# EAGLE design StandaloneAnemometer_RevA (EAGLE 7.4.0)

## Sheet 1 of 3
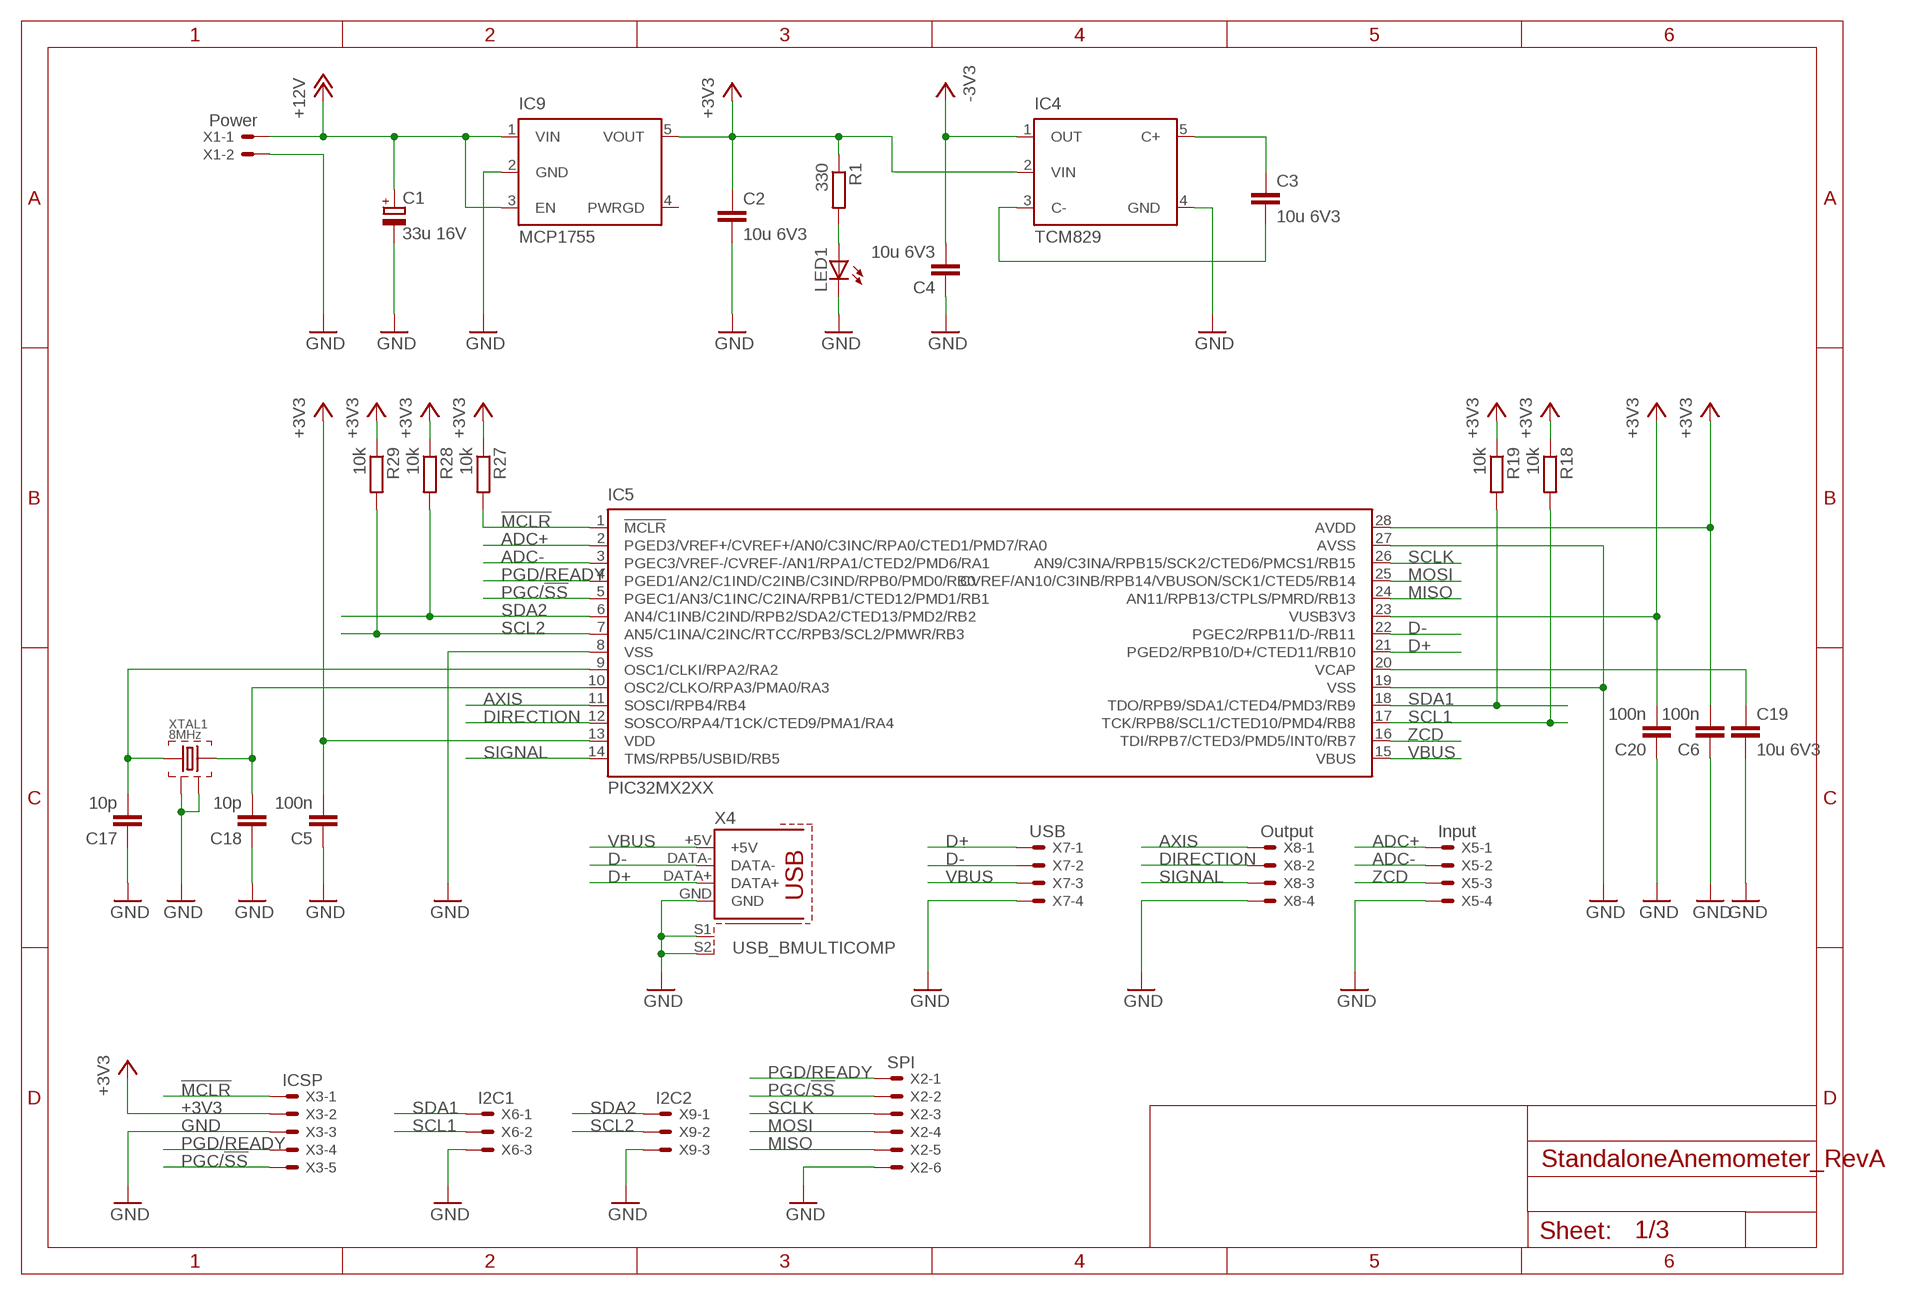
[diagram p0: schematic, sheet 1]

### Parts
C1  33u 16V  C_POLARIZEDSMC_B  [SMC_B]
C2  10u 6V3  CC0805  [C0805]
C3  10u 6V3  CC0805  [C0805]
C4  10u 6V3  CC0805  [C0805]
C5  100n  CC0805  [C0805]
C6  100n  CC0805  [C0805]
C17  10p  CC0805  [C0805]
C18  10p  CC0805  [C0805]
C19  10u 6V3  CC0805  [C0805]
C20  100n  CC0805  [C0805]
IC4  TCM829  [SOT-23-5]
IC5  PIC32MX2XX  [SO28W]
IC9  MCP1755  [SOT-23-5]
LED1  LED0805  [LED0805]
R1  330  RESISTORR0805  [R0805]
R18  10k  RESISTORR0805  [R0805]
R19  10k  RESISTORR0805  [R0805]
R27  10k  RESISTORR0805  [R0805]
R28  10k  RESISTORR0805  [R0805]
R29  10k  RESISTORR0805  [R0805]
X1  Power  22-23-2021100MIL  [22-23-2021]
X2  SPI  22-23-2061  [22-23-2061]
X3  ICSP  22-23-2051  [22-23-2051]
X4  USB_BMULTICOMP  [USB_B]
X5  Input  22-23-20411MM  [22-23-2041]
X6  I2C1  22-23-2031  [22-23-2031]
X7  USB  22-23-20411MM  [22-23-2041]
X8  Output  22-23-20411MM  [22-23-2041]
X9  I2C2  22-23-2031  [22-23-2031]
XTAL1  8MHz  CRYSTAL_SHIELDED  [5X3.2MM]

### Nets
!MCLR!: IC5.1(!MCLR!) R27.2 X3.1
+3V3: C2.1 C5.2 C6.2 C20.2 IC4.2(VIN) IC5.13(VDD) IC5.23(VUSB3V3) IC5.28(AVDD) IC9.5(VOUT) R1.1 R18.1 R19.1 R27.1 R28.1 R29.1 X3.2 ; also sheet 2,3
+12V: C1.+ IC9.1(VIN) IC9.3(EN) X1.1 ; also sheet 2
-3V3: C4.2 IC4.1(OUT) ; also sheet 2,3
ADC+: IC5.2(PGED3/VREF+/CVREF+/AN0/C3INC/RPA0/CTED1/PMD7/RA0) X5.1 ; also sheet 3
ADC-: IC5.3(PGEC3/VREF-/CVREF-/AN1/RPA1/CTED2/PMD6/RA1) X5.2 ; also sheet 3
AXIS: IC5.11(SOSCI/RPB4/RB4) X8.1 ; also sheet 2,3
D+: IC5.21(PGED2/RPB10/D+/CTED11/RB10) X4.DATA+ X7.1
D-: IC5.22(PGEC2/RPB11/D-/RB11) X4.DATA- X7.2
DIRECTION: IC5.12(SOSCO/RPA4/T1CK/CTED9/PMA1/RA4) X8.2 ; also sheet 2,3
GND: C1.- C2.2 C4.1 C5.1 C6.1 C17.1 C18.1 C19.2 C20.1 IC4.4(GND) IC5.8(VSS) IC5.19(VSS) IC5.27(AVSS) IC9.2(GND) LED1.C X1.2 X2.6 X3.3 X4.GND X4.S1 X4.S2 X5.4 X6.3 X7.4 X8.4 X9.3 XTAL1.2 XTAL1.4 ; also sheet 2,3
MISO: IC5.24(AN11/RPB13/CTPLS/PMRD/RB13) X2.5
MOSI: IC5.25(CVREF/AN10/C3INB/RPB14/VBUSON/SCK1/CTED5/RB14) X2.4
N$1: LED1.A R1.2
N$3: C3.2 IC4.3(C-)
N$4: C3.1 IC4.5(C+)
N$5: C17.2 IC5.9(OSC1/CLKI/RPA2/RA2) XTAL1.1
N$9: C18.2 IC5.10(OSC2/CLKO/RPA3/PMA0/RA3) XTAL1.3
N$11: C19.1 IC5.20(VCAP)
PGC/!SS!: IC5.5(PGEC1/AN3/C1INC/C2INA/RPB1/CTED12/PMD1/RB1) X2.2 X3.5
PGD/READY: IC5.4(PGED1/AN2/C1IND/C2INB/C3IND/RPB0/PMD0/RB0) X2.1 X3.4
SCL1: IC5.17(TCK/RPB8/SCL1/CTED10/PMD4/RB8) R18.2 X6.2
SCL2: IC5.7(AN5/C1INA/C2INC/RTCC/RPB3/SCL2/PMWR/RB3) R29.2 X9.2 ; also sheet 3
SCLK: IC5.26(AN9/C3INA/RPB15/SCK2/CTED6/PMCS1/RB15) X2.3
SDA1: IC5.18(TDO/RPB9/SDA1/CTED4/PMD3/RB9) R19.2 X6.1
SDA2: IC5.6(AN4/C1INB/C2IND/RPB2/SDA2/CTED13/PMD2/RB2) R28.2 X9.1 ; also sheet 3
SIGNAL: IC5.14(TMS/RPB5/USBID/RB5) X8.3 ; also sheet 2
VBUS: IC5.15(VBUS) X4.+5V X7.3
ZCD: IC5.16(TDI/RPB7/CTED3/PMD5/INT0/RB7) X5.3 ; also sheet 3
Unconnected: IC9.4(PWRGD)

## Sheet 2 of 3
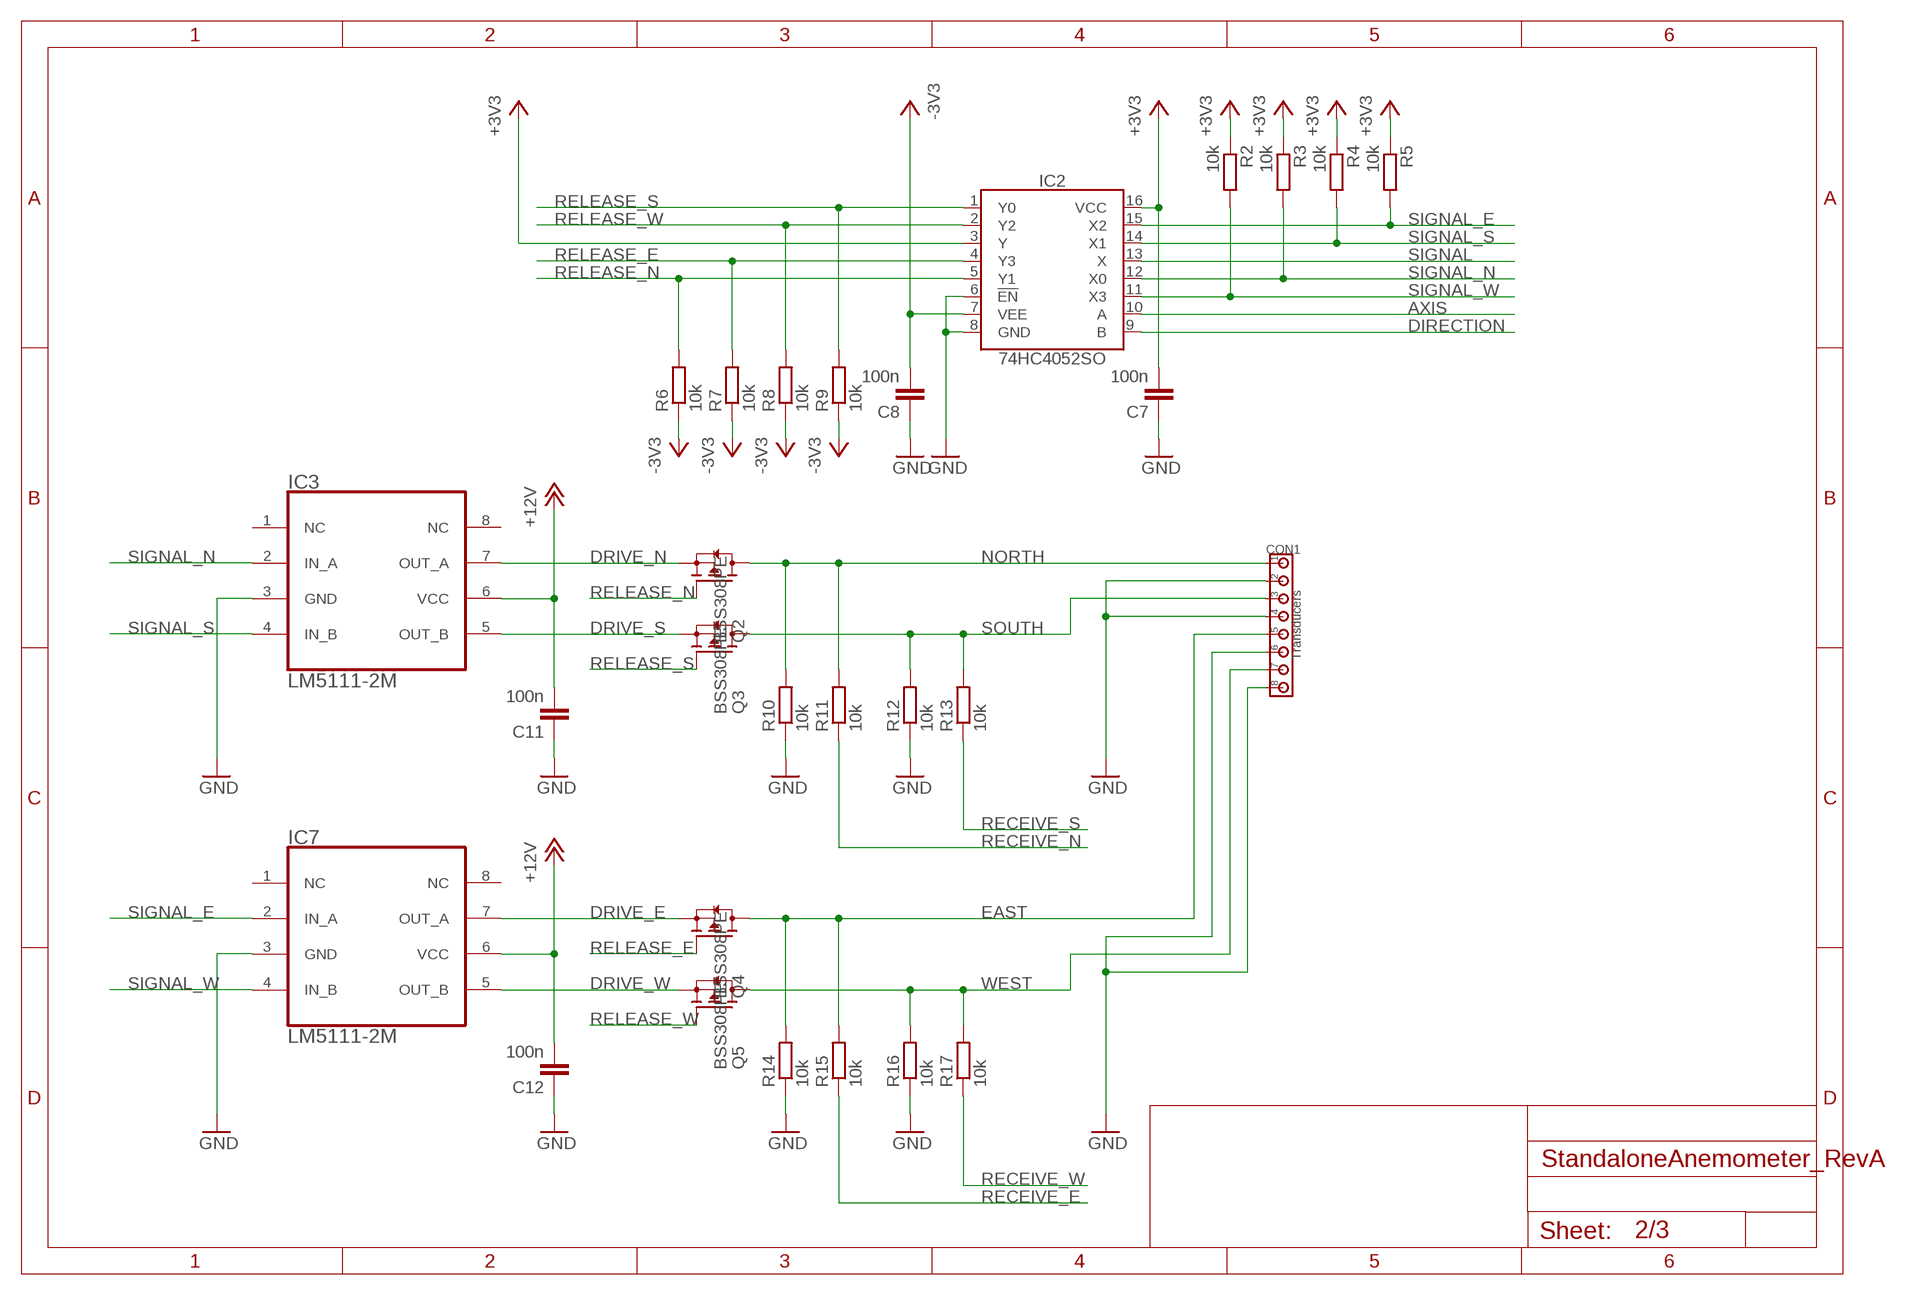
[diagram p1: schematic, sheet 2]

### Parts
C7  100n  CC0805  [C0805]
C8  100n  CC0805  [C0805]
C11  100n  CC0805  [C0805]
C12  100n  CC0805  [C0805]
CON1  Transducers  CON_8X3.5MM  [3.5MM_8X]
IC2  74HC4052SO  [SO16]
IC3  LM5111-2M  LM5111  [SOIC8]
IC7  LM5111-2M  LM5111  [SOIC8]
Q2  BSS308PE  P-FET  [SOT23]
Q3  BSS308PE  P-FET  [SOT23]
Q4  BSS308PE  P-FET  [SOT23]
Q5  BSS308PE  P-FET  [SOT23]
R2  10k  RESISTORR0805  [R0805]
R3  10k  RESISTORR0805  [R0805]
R4  10k  RESISTORR0805  [R0805]
R5  10k  RESISTORR0805  [R0805]
R6  10k  RESISTORR0805  [R0805]
R7  10k  RESISTORR0805  [R0805]
R8  10k  RESISTORR0805  [R0805]
R9  10k  RESISTORR0805  [R0805]
R10  10k  RESISTORR0805  [R0805]
R11  10k  RESISTORR0805  [R0805]
R12  10k  RESISTORR0805  [R0805]
R13  10k  RESISTORR0805  [R0805]
R14  10k  RESISTORR0805  [R0805]
R15  10k  RESISTORR0805  [R0805]
R16  10k  RESISTORR0805  [R0805]
R17  10k  RESISTORR0805  [R0805]

### Nets
+3V3: C7.2 IC2.3(Y) IC2.16(VCC) R2.1 R3.1 R4.1 R5.1 ; also sheet 1,3
+12V: C11.2 C12.2 IC3.6(VCC) IC7.6(VCC) ; also sheet 1
-3V3: C8.2 IC2.7(VEE) R6.1 R7.1 R8.1 R9.1 ; also sheet 1,3
AXIS: IC2.10(A) ; also sheet 1,3
DIRECTION: IC2.9(B) ; also sheet 1,3
DRIVE_E: IC7.7(OUT_A) Q4.2(S)
DRIVE_N: IC3.7(OUT_A) Q2.2(S)
DRIVE_S: IC3.5(OUT_B) Q3.2(S)
DRIVE_W: IC7.5(OUT_B) Q5.2(S)
EAST: CON1.5 Q4.3(D) R14.2 R15.2
GND: C7.1 C8.1 C11.1 C12.1 CON1.2 CON1.4 CON1.6 CON1.8 IC2.6(!EN!) IC2.8(GND) IC3.3(GND) IC7.3(GND) R10.1 R12.1 R14.1 R16.1 ; also sheet 1,3
NORTH: CON1.1 Q2.3(D) R10.2 R11.2
RECEIVE_E: R15.1 ; also sheet 3
RECEIVE_N: R11.1 ; also sheet 3
RECEIVE_S: R13.1 ; also sheet 3
RECEIVE_W: R17.1 ; also sheet 3
RELEASE_E: IC2.4(Y3) Q4.1(G) R7.2
RELEASE_N: IC2.5(Y1) Q2.1(G) R6.2
RELEASE_S: IC2.1(Y0) Q3.1(G) R9.2
RELEASE_W: IC2.2(Y2) Q5.1(G) R8.2
SIGNAL: IC2.13(X) ; also sheet 1
SIGNAL_E: IC2.15(X2) IC7.2(IN_A) R5.2
SIGNAL_N: IC2.12(X0) IC3.2(IN_A) R3.2
SIGNAL_S: IC2.14(X1) IC3.4(IN_B) R4.2
SIGNAL_W: IC2.11(X3) IC7.4(IN_B) R2.2
SOUTH: CON1.3 Q3.3(D) R12.2 R13.2
WEST: CON1.7 Q5.3(D) R16.2 R17.2
Unconnected: IC3.1(NC) IC3.8(NC) IC7.1(NC) IC7.8(NC)

## Sheet 3 of 3
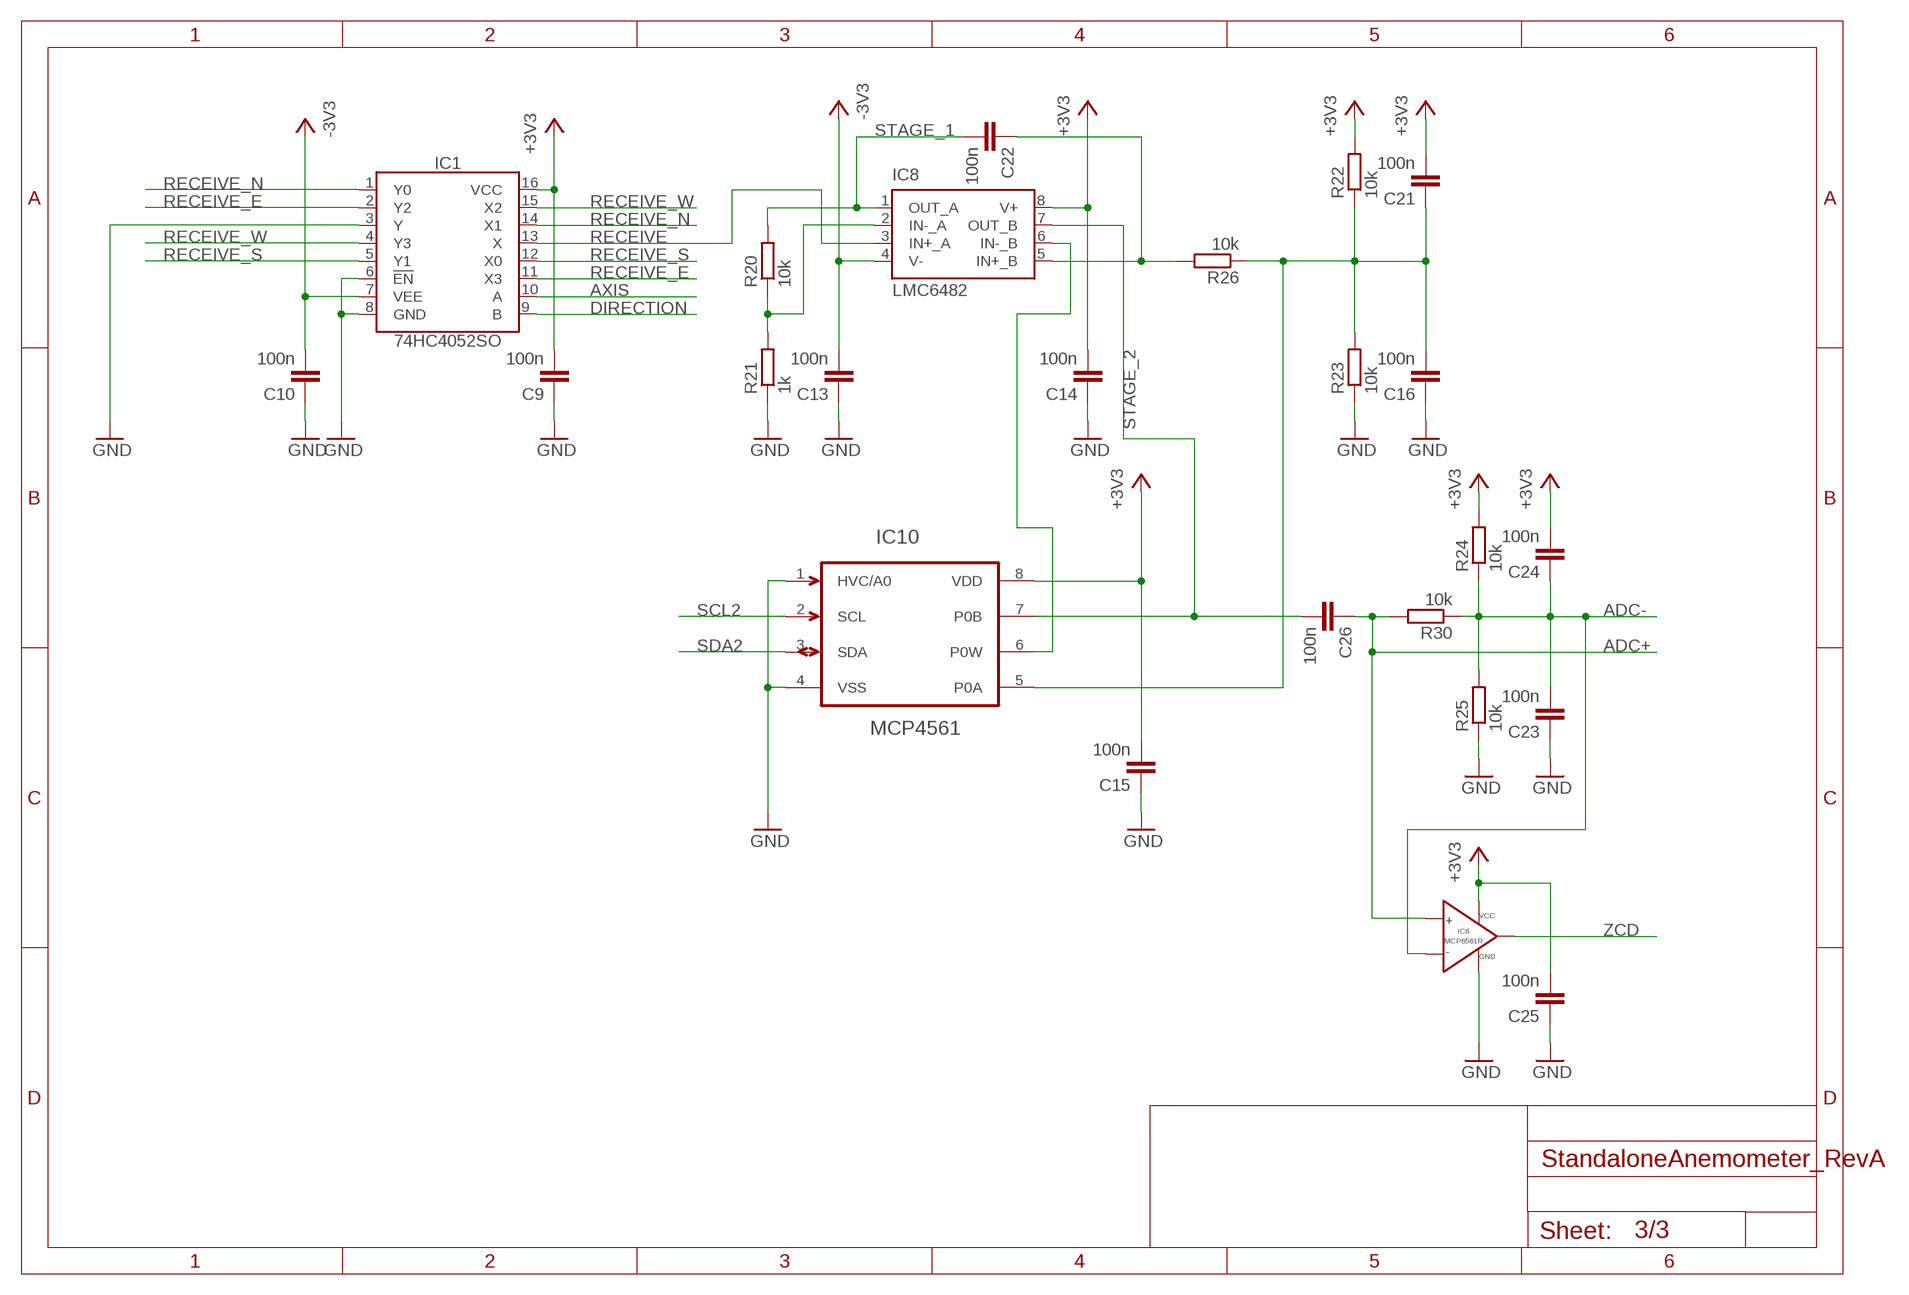
[diagram p2: schematic, sheet 3]

### Parts
C9  100n  CC0805  [C0805]
C10  100n  CC0805  [C0805]
C13  100n  CC0805  [C0805]
C14  100n  CC0805  [C0805]
C15  100n  CC0805  [C0805]
C16  100n  CC0805  [C0805]
C21  100n  CC0805  [C0805]
C22  100n  CC0805  [C0805]
C23  100n  CC0805  [C0805]
C24  100n  CC0805  [C0805]
C25  100n  CC0805  [C0805]
C26  100n  CC0805  [C0805]
IC1  74HC4052SO  [SO16]
IC6  MCP6561R  [SOT-23-5]
IC8  LMC6482  [SOIC8]
IC10  MCP4561  MCP4561MSOP  [MSOP]
R20  10k  RESISTORR0805  [R0805]
R21  1k  RESISTORR0805  [R0805]
R22  10k  RESISTORR0805  [R0805]
R23  10k  RESISTORR0805  [R0805]
R24  10k  RESISTORR0805  [R0805]
R25  10k  RESISTORR0805  [R0805]
R26  10k  RESISTORR0805  [R0805]
R30  10k  RESISTORR0805  [R0805]

### Nets
+3V3: C9.2 C14.2 C15.2 C21.2 C24.2 C25.2 IC1.16(VCC) IC6.2(VCC) IC8.8(V+) IC10.8(VDD) R22.2 R24.2 ; also sheet 1,2
-3V3: C10.2 C13.2 IC1.7(VEE) IC8.4(V-) ; also sheet 1,2
ADC+: C26.1 IC6.3(VIN+) R30.2 ; also sheet 1
ADC-: C23.2 C24.1 IC6.4(VIN-) R24.1 R25.2 R30.1 ; also sheet 1
AXIS: IC1.10(A) ; also sheet 1,2
DIRECTION: IC1.9(B) ; also sheet 1,2
FB1: IC8.2(IN-_A) R20.1 R21.2
FB2: IC8.6(IN-_B) IC10.6(P0W)
GND: C9.1 C10.1 C13.1 C14.1 C15.1 C16.1 C23.1 C25.1 IC1.3(Y) IC1.6(!EN!) IC1.8(GND) IC6.5(GND) IC10.1(HVC/A0) IC10.4(VSS) R21.1 R23.1 R25.1 ; also sheet 1,2
N$27: C16.2 C21.1 IC10.5(P0A) R22.1 R23.2 R26.1
RECEIVE: IC1.13(X) IC8.3(IN+_A)
RECEIVE_E: IC1.2(Y2) IC1.11(X3) ; also sheet 2
RECEIVE_N: IC1.1(Y0) IC1.14(X1) ; also sheet 2
RECEIVE_S: IC1.5(Y1) IC1.12(X0) ; also sheet 2
RECEIVE_W: IC1.4(Y3) IC1.15(X2) ; also sheet 2
SCL2: IC10.2(SCL) ; also sheet 1
SDA2: IC10.3(SDA) ; also sheet 1
STAGE2_IN: C22.1 IC8.5(IN+_B) R26.2
STAGE_1: C22.2 IC8.1(OUT_A) R20.2
STAGE_2: C26.2 IC8.7(OUT_B) IC10.7(P0B)
ZCD: IC6.1(VOUT) ; also sheet 1

## Library data of the parts
C1 = 00Capacitor:C_POLARIZED
C2-C26 = 00Capacitor:C: Capacitor
CON1 = 00Connector:CON_8X: 8-pin header
IC1 IC2 = 00Logic:74HC4052
IC3 IC7 = 00Logic:LM5111: Dual 5A Compound Gate Driver
IC4 = 00VoltageRegulator:TCM829
IC5 = 00PIC:PIC32MX2XX
IC6 = 00OpAmp:MCP6561R: 1.8V Low-Power Push-Pull Output Comparator Propagation delay 80ns max
IC8 = 00OpAmp:LMC6482: CMOS Dual Rail-to-Rail Input and Output Operational Amplifier
IC9 = 00VoltageRegulator:MCP1755
IC10 = 00DigiPot:MCP4561: Digital POT
LED1 = 00Display:LED: LED
Q2-Q5 = 00Mosfet:P-FET
R1-R30 = 00Resistor:RESISTOR: RESISTOR, European symbol
X1 = 00Connector:22-23-2021: .100" (2.54mm) Center Header - 2 Pin; MF: MOLEX; MPN: 22-23-2021; OC_FARNELL: 1462926; OC_NEWARK: 25C3832
X2 = 00Connector:22-23-2061: .100" (2.54mm) Center Header - 6 Pin; MF: MOLEX; MPN: 22-23-2061; OC_FARNELL: 1462922; OC_NEWARK: 27C1933
X3 = 00Connector:22-23-2051: .100" (2.54mm) Center Header - 5 Pin; MF: MOLEX; MPN: 22-23-2051; OC_FARNELL: 1462952; OC_NEWARK: 38C9178
X4 = 00Connector:USB_B: Type B USB connector
X5 X7 X8 = 00Connector:22-23-2041: .100" (2.54mm) Center Header - 4 Pin
X6 X9 = 00Connector:22-23-2031: .100" (2.54mm) Center Header - 3 Pin; MF: MOLEX; MPN: 22-23-2031; OC_FARNELL: 1462950; OC_NEWARK: 30C0862
XTAL1 = 00Crystal:CRYSTAL_SHIELDED: Shielded Crystal

## Board
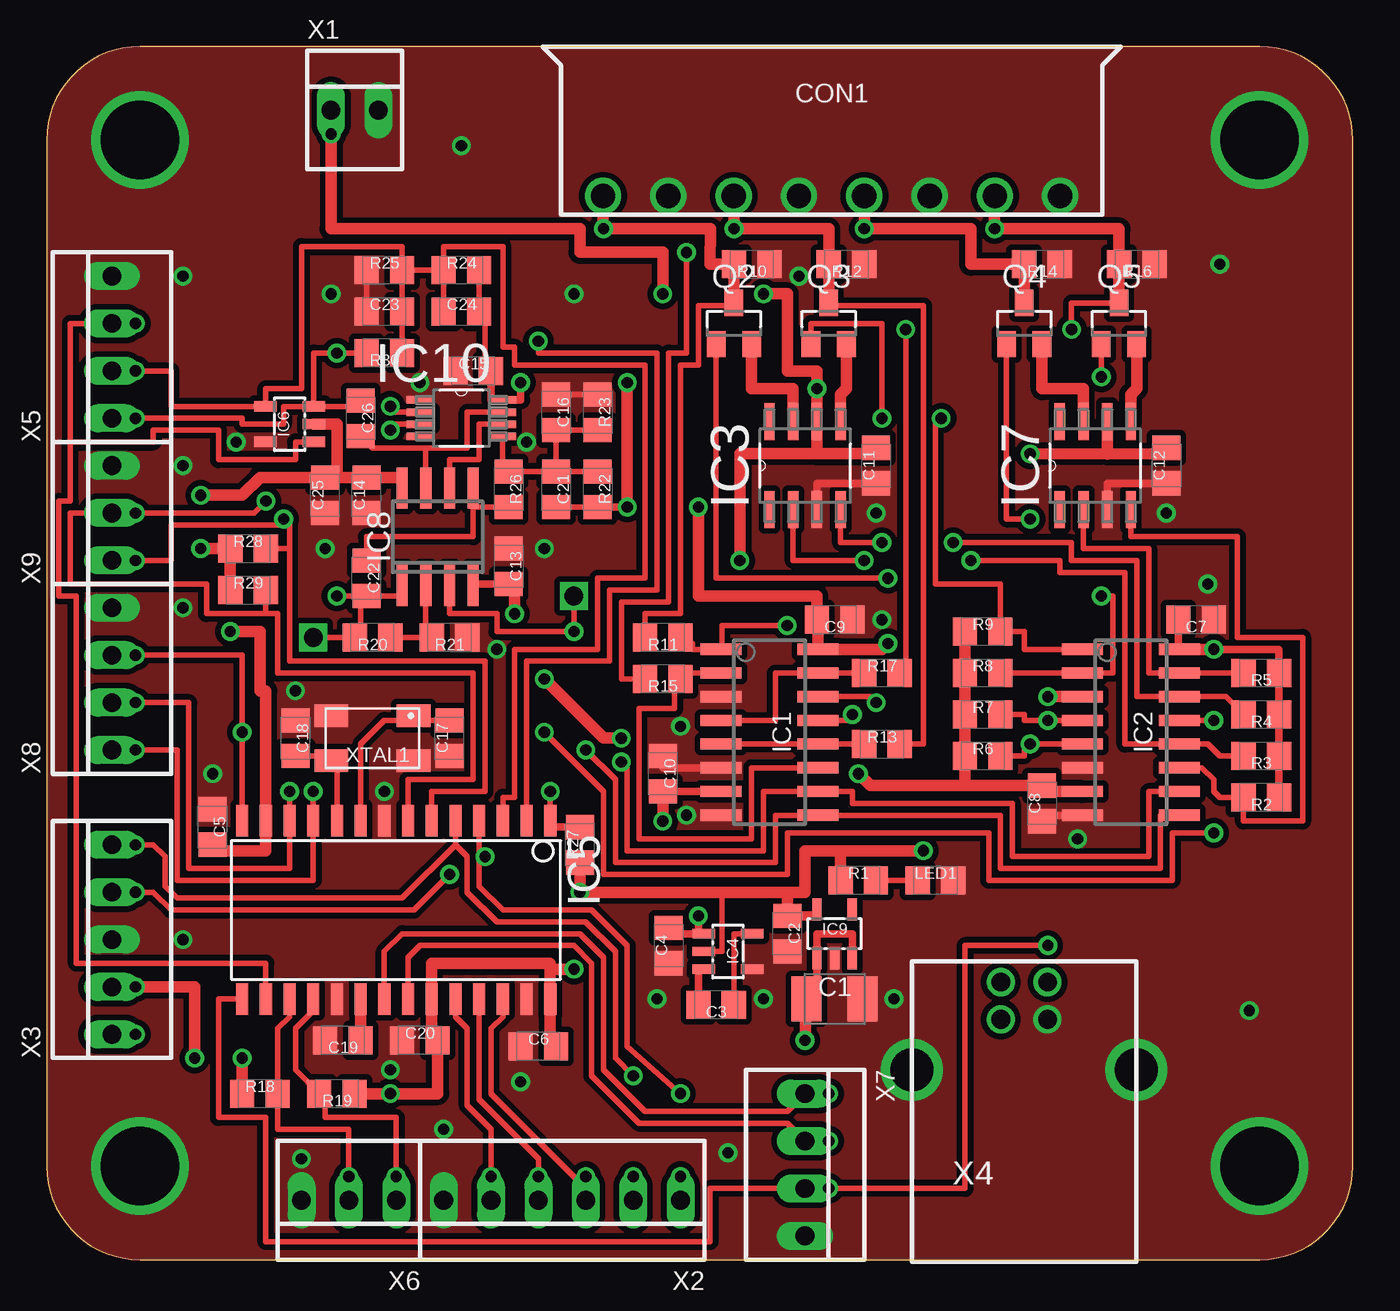
[diagram p3: board, top side]
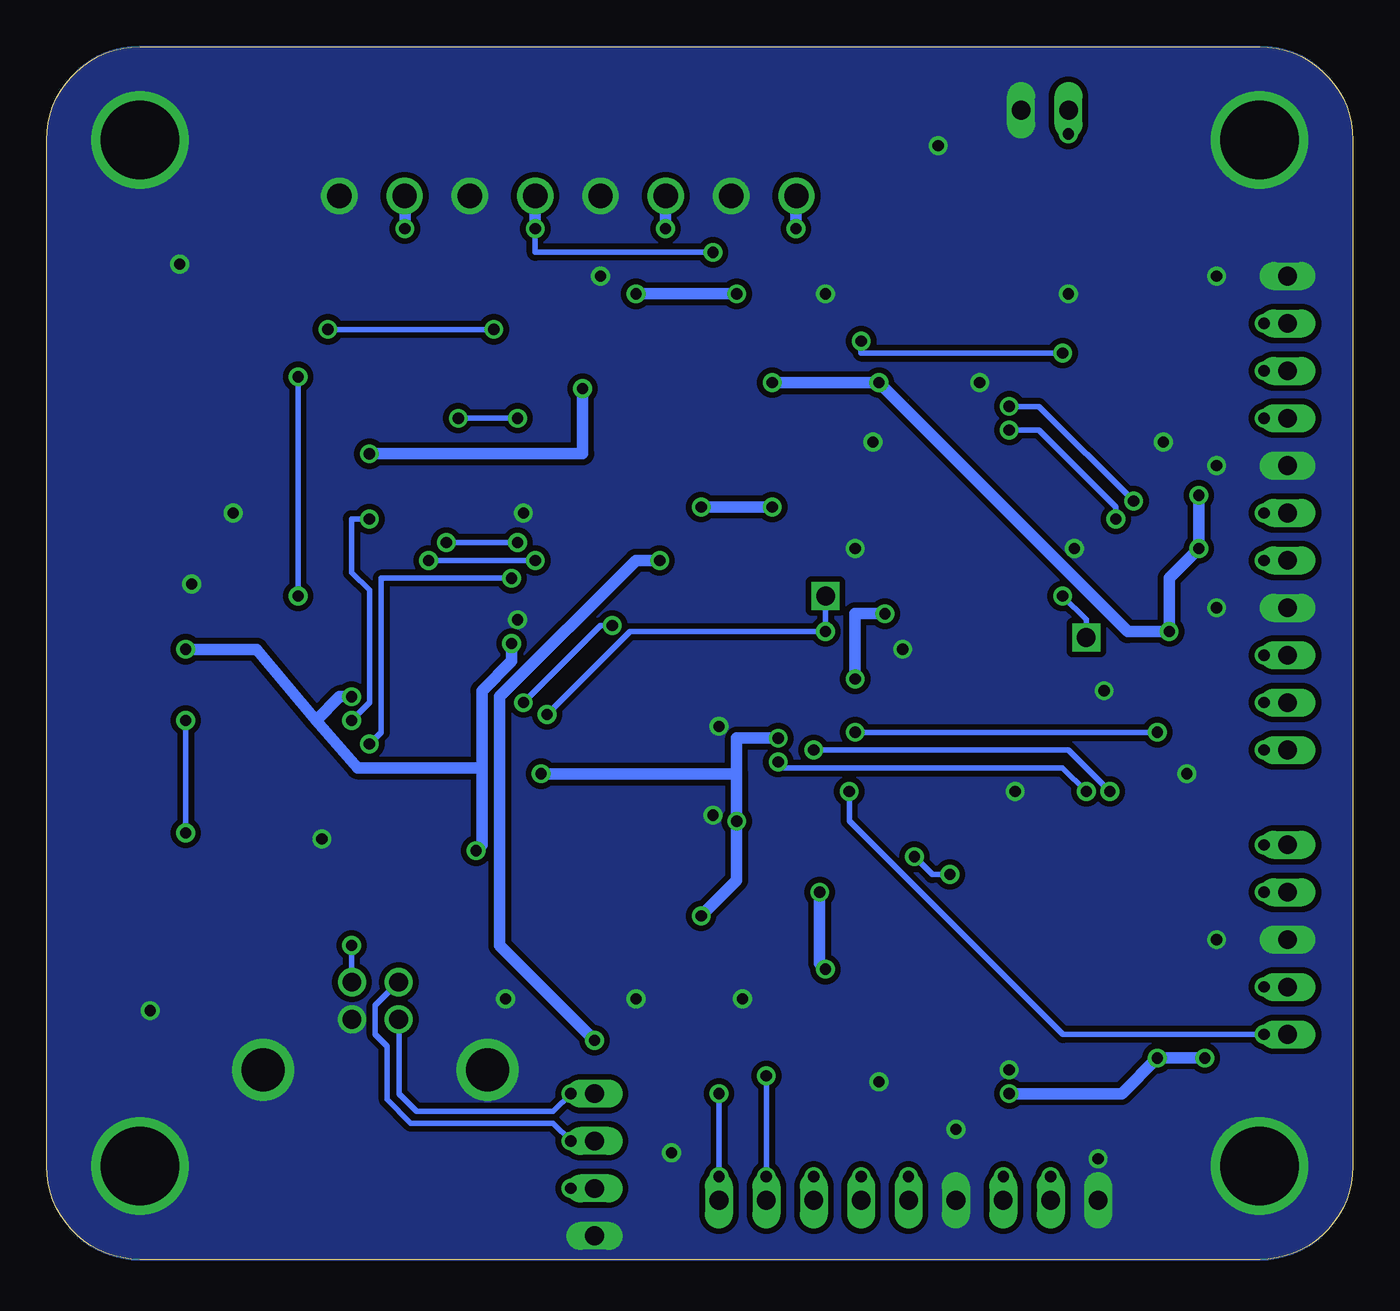
[diagram p4: board, bottom side, seen from below]

Size 70 x 65 mm. Coordinates in mm from the lower left corner, seen from the top.
Outline: 5,0 65,0 arc90 70,5 70,60 arc90 65,65 5,65 arc90 0,60 0,5 arc90 5,0
Copper layers (1*16): Top 0.035mm / dielectric 1.5mm / Bottom 0.035mm
Design rules "default *": minimum track width 10mil, minimum drill 0.6mm, track to track 8mil, track to pad 8mil, pad to pad 8mil, via to via 8mil, smd to smd 8mil, copper to edge 0mil, drill to drill 8mil, minimum pad ring 10mil, minimum via ring 8mil, stop-mask expansion 4mil, vias tented up to drill 0mil, thermal gap 10mil

### Footprints (pad centres in the part's own frame; a part is rotated, then mirrored left to right if it is on the bottom)
SMC_B = smd 1.6 x 2.4: + -1.5,0; - 1.5,0
C0805 = smd 1.3 x 1.5: 1 -0.95,0; 2 0.95,0
3.5MM_8X = drill 1.3: 1 -12.25,0; 2 -8.75,0; 3 -5.25,0; 4 -1.75,0; 5 1.75,0; 6 5.25,0; 7 8.75,0; 8 12.25,0
SO16 = smd 0.6 x 2.2: 1 -4.445,-2.6; 2 -3.175,-2.6; 3 -1.905,-2.6; 4 -0.635,-2.6; 5 0.635,-2.6; 6 1.905,-2.6; 7 3.175,-2.6; 8 4.445,-2.6; 9 4.445,2.6; 10 3.175,2.6; 11 1.905,2.6; 12 0.635,2.6; 13 -0.635,2.6; 14 -1.905,2.6; 15 -3.175,2.6; 16 -4.445,2.6
SOIC8 = smd 1.981 x 0.559: 1 -2.362,1.905; 2 -2.362,0.635; 3 -2.362,-0.635; 4 -2.362,-1.905; 5 2.362,-1.905; 6 2.362,-0.635; 7 2.362,0.635; 8 2.362,1.905
SOT-23-5 = smd 0.5 x 1.2: 1 -0.95,-1.3; 2 0,-1.3; 3 0.95,-1.3; 4 0.95,1.3; 5 -0.95,1.3
SO28W = smd 0.65 x 1.7: 1 -7.62,-4.78; 2 -6.35,-4.78; 3 -5.08,-4.78; 4 -3.81,-4.78; 5 -2.54,-4.78; 6 -1.27,-4.78; 7 0,-4.78; 8 1.27,-4.78; 9 2.54,-4.78; 10 3.81,-4.78; 11 5.08,-4.78; 12 6.35,-4.78; 13 7.62,-4.78; 14 8.89,-4.78; 15 8.89,4.78; 16 7.62,4.78; 17 6.35,4.78; 18 5.08,4.78; 19 3.81,4.78; 20 2.54,4.78; 21 1.27,4.78; 22 0,4.78; 23 -1.27,4.78; 24 -2.54,4.78; 25 -3.81,4.78; 26 -5.08,4.78; 27 -6.35,4.78; 28 -7.62,4.78
SOT-23-5' = smd 0.55 x 1.2: 1 -0.95,-1.3; 2 0,-1.3; 3 0.95,-1.3; 4 0.95,1.3; 5 -0.95,1.3
SOIC8' = smd 2.2 x 0.6: 1 2.6,-1.905; 2 2.6,-0.635; 3 2.6,0.635; 4 2.6,1.905; 5 -2.6,1.905; 6 -2.6,0.635; 7 -2.6,-0.635; 8 -2.6,-1.905
MSOP = smd 1.45 x 0.4: 1 -2.2,0.975; 2 -2.2,0.325; 3 -2.2,-0.325; 4 -2.2,-0.975; 5 2.2,-0.975; 6 2.2,-0.325; 7 2.2,0.325; 8 2.2,0.975
LED0805 = smd 1.3 x 1.5: A -0.95,0; C 0.95,0
SOT23 = smd 1 x 1.4: 1 -0.95,-1.1; 2 0.95,-1.1; 3 0,1.1
R0805 = smd 1.3 x 1.5: 1 -0.95,0; 2 0.95,0
22-23-2021 = drill 1 long: 1 -1.27,0; 2 1.27,0
22-23-2061 = drill 1 long: 1 -6.35,0; 2 -3.81,0; 3 -1.27,0; 4 1.27,0; 5 3.81,0; 6 6.35,0
22-23-2051 = drill 1 long: 1 -5.08,0; 2 -2.54,0; 3 0,0; 4 2.54,0; 5 5.08,0
USB_B = drill 1: +5V 1.25,4.71; DATA+ -1.25,2.71; DATA- -1.25,4.71; GND 1.25,2.71 | drill 2.3 pad 2.9: S1 -6.02,0; S2 6.02,0
22-23-2041 = drill 1 long: 1 -3.81,0; 2 -1.27,0; 3 1.27,0; 4 3.81,0
22-23-2031 = drill 1 long: 1 -2.54,0; 2 0,0; 3 2.54,0
5X3.2MM = smd 1.8 x 1.2: 1 -2.2,-1.2; 2 2.2,-1.2; 3 2.2,1.2; 4 -2.2,1.2

### Placement (x,y rotation side)
C1  42.23,13.97 0 top
C2  39.69,17.46 270 top
C3  35.88,13.65 180 top
C4  33.34,16.83 90 top
C5  8.89,23.18 270 top
C6  26.35,11.43 0 top
C7  61.59,34.29 180 top
C8  53.34,24.45 90 top
C9  42.23,34.29 180 top
C10  33.02,26.04 270 top
C11  44.45,42.55 90 top
C12  60.01,42.55 90 top
C13  24.77,37.15 270 top
C14  17.14,40.96 90 top
C15  22.86,47.62 0 top
C16  27.3,45.4 270 top
C17  21.59,27.94 90 top
C18  13.34,27.94 270 top
C19  15.88,11.75 180 top
C20  20,11.75 0 top
C21  27.3,41.27 270 top
C22  17.14,36.51 270 top
C23  18.1,50.8 0 top
C24  22.23,50.8 0 top
C25  14.92,40.96 90 top
C26  16.83,45.09 270 top
CON1  42.07,57 0 top
IC1  38.73,28.26 270 top
IC2  58.1,28.26 270 top
IC3  40.64,42.55 90 top
IC4  36.51,16.51 270 top
IC5  19.37,18.73 180 top
IC6  MCP6561R  [SOT-23-5']  13.02,44.77 90 top
IC7  56.2,42.55 90 top
IC8  LMC6482  [SOIC8']  20.95,38.73 270 top
IC9  42.23,17.46 0 top
IC10  22.23,45.09 0 top
LED1  47.62,20.32 0 top
Q2  36.83,50.16 0 top
Q3  41.91,50.16 0 top
Q4  52.39,50.16 0 top
Q5  57.47,50.16 0 top
R1  43.5,20.32 0 top
R2  65.09,24.77 180 top
R3  65.09,26.99 180 top
R4  65.09,29.21 180 top
R5  65.09,31.43 180 top
R6  50.16,26.99 0 top
R7  50.16,29.21 0 top
R8  50.16,31.43 0 top
R9  50.16,33.66 0 top
R10  37.78,53.34 180 top
R11  33.02,33.34 180 top
R12  42.86,53.34 180 top
R13  44.77,27.62 0 top
R14  53.34,53.34 180 top
R15  33.02,31.11 180 top
R16  58.42,53.34 180 top
R17  44.77,31.43 0 top
R18  11.43,8.89 0 top
R19  15.56,8.89 180 top
R20  17.46,33.34 180 top
R21  21.59,33.34 180 top
R22  29.53,41.27 270 top
R23  29.53,45.4 270 top
R24  22.23,53.02 0 top
R25  18.1,53.02 0 top
R26  24.77,41.27 270 top
R27  28.57,22.23 90 top
R28  10.79,38.1 0 top
R29  10.79,35.88 0 top
R30  18.1,48.58 180 top
X1  16.51,61.59 0 top
X2  27.62,3.17 180 top
X3  3.49,17.14 90 top
X4  52.39,10.16 0 top
X5  3.49,48.9 90 top
X6  16.19,3.17 180 top
X7  40.64,5.08 270 top
X8  3.49,31.11 90 top
X9  3.49,40.01 90 top
XTAL1  17.46,27.94 180 top

### Tracks (layer width: path | path; a pad name or v marks a point on that pad's centre or on a via)
!MCLR!  (via drill 0.6)
  Top 0.305: 28.57,23.49 R27.2 | IC5.1 v26.99,25.08 | X3.1 v4.76,12.06
  Top 0.406: IC5.1 26.99,23.18 R27.2
  Bottom 0.305: v4.76,12.06 15.54,12.06 IC5.1 v26.99,25.08
+3V3  (via drill 0.6)  (1 unrouted)
  Top 0.305: 36.2,19.68 36.2,16.51 IC4.2 | 39.37,18.41 C2.1 | IC8.8 19.05,41.91 | 23.81,46.05 23.81,46.04 | C15.2 23.5,47.62 23.5,50.8 C24.2 R24.2 | C21.2 R22.2 | 15.56,41.91 C25.2 | 8.89,21.91 C5.2 | 26.99,11.43 C6.2 | 20.64,11.43 C20.2
  Top 0.406: IC2.16 60.65,32.7 C7.2 | C9.2 41.34,34.29 | 41.28,18.41 IC9.5 | v31.11,40.32 R22.2 | R2.1 R3.1 R4.1 R5.1 66.04,32.7 v62.55,32.7 | 26.99,15.88 26.99,15.56 | 39.69,18.1 C2.1 | v25.4,46.99 25.4,46.06 IC10.8 23.81,46.06 C15.2
  Top 0.508: C2.1 41.28,18.41
  Top 0.61: 41.34,34.29 IC1.16 44.77,32.7 v45.09,33.02 | C9.2 41.28,35.56 34.92,35.56 v34.92,40.32 | IC2.16 v62.55,32.7 | 19.05,41.91 C14.2 15.56,41.91 15.56,44.77 IC6.2 | 8.89,21.91 11.75,21.91 IC5.13 11.75,30.48 11.43,30.48 11.43,33.66 v9.84,33.66 | 26.99,11.43 IC5.28 26.99,15.56 v28.26,15.56 | 20.64,11.43 IC5.23 20.64,15.88 26.99,15.88 | v8.26,38.1 R28.1 R29.1 | R18.1 v10.48,10.79 | R19.1 v18.41,8.89 20.95,8.89 C20.2 | X3.2 v4.76,14.61 7.94,14.61 v7.94,10.79 | IC2.3 v53.66,30.16 | R27.1 v28.57,19.68 36.2,19.68 39.69,19.68 | v31.11,46.99 v31.11,40.32 | C2.1 39.69,19.68 | 39.69,19.68 40.64,19.68 40.64,21.91 42.55,21.91 | 42.55,21.91 v46.99,21.91 | R1.1 42.55,20.64 42.55,21.91 | v8.26,40.96 10.48,40.96 11.43,41.91 C25.2
  Bottom 0.61: v45.09,33.02 45.09,32.07 46.67,30.48 46.67,26.35 | v31.11,40.32 v34.92,40.32 | v31.11,46.99 v25.4,46.99 12.06,33.66 v9.84,33.66 9.84,36.51 v8.26,38.1 v8.26,40.96 | v7.94,10.79 v10.48,10.79 12.38,8.89 v18.41,8.89 | 55.56,28.89 53.34,26.35 46.67,26.35 | 55.56,28.89 58.74,32.7 v62.55,32.7 | v53.66,30.16 54.29,30.16 55.56,28.89 | v28.57,19.68 28.57,15.88 v28.26,15.56 | 46.67,26.35 46.67,22.23 v46.99,21.91
+12V  (via drill 0.6)
  Top 0.305: 41.27,14.29 41.28,14.29
  Top 0.406: 41.28,14.29 IC9.1 41.28,17.46 43.18,17.46 IC9.3 | 41.27,14.29 C1.+
  Top 0.61: IC7.6 56.83,43.18 | 56.83,43.18 60.01,43.18 C12.2 | 56.83,43.18 v52.7,43.18 | 41.27,43.18 IC3.6 v41.27,46.67 41.27,47.62 39.69,47.62 39.69,51.75 v38.42,51.75 | 41.27,43.18 44.45,43.18 C11.2 | X1.1 v15.24,60.33 15.24,55.24 28.57,55.24 28.57,53.98 33.02,53.98 v33.02,51.75 | 41.27,43.18 37.15,43.18 v37.15,37.47 | v40.64,11.75 C1.+
  Bottom 0.61: v52.7,43.18 41.27,43.18 v41.27,46.67 | v38.42,51.75 v33.02,51.75 | v37.15,37.47 38.42,37.47 45.72,30.16 45.72,16.83 v40.64,11.75
-3V3  (via drill 0.6)
  Top 0.305: IC8.4 22.86,36.2
  Top 0.406: IC1.7 C10.2 | IC4.1 | 33.34,17.46 C4.2 33.34,17.46 IC4.1 | 22.86,36.2 C13.2 arc-90 25.08,35.88 | v34.92,18.41 34.92,17.46 IC4.1
  Top 0.61: C10.2 v33.02,23.5 | R9.1 R8.1 R7.1 R6.1 49.22,25.4 | IC2.7 53.34,25.08 C8.2 49.22,25.4 | 49.22,25.4 44.13,25.4 v43.5,26.04 | v30.8,27.94 29.84,27.94 v26.67,31.11 | 25.08,35.88 v25.08,34.61
  Bottom 0.61: v43.5,26.04 33.02,26.04 | 33.02,26.04 v33.02,23.5 33.02,20.32 v34.92,18.41 | v26.67,31.11 26.67,34.61 v25.08,34.61 | 33.02,26.04 33.02,27.94 v30.8,27.94
ADC+  (via drill 0.6)
  Top 0.305: IC6.3 14.32,48.58 v15.56,48.58 R30.2 | IC6.3 16.51,45.72 C26.1 | IC6.3 12.7,45.72 12.7,44.77 10.48,44.77 10.48,45.09 v4.76,45.09 X5.1 | IC5.2 25.72,32.07 30.16,32.07 30.16,35.88 32.7,35.88 32.7,48.58 26.35,48.58 v26.35,49.21
  Bottom 0.305: v26.35,49.21 26.35,48.58 v15.56,48.58
ADC-  (via drill 0.6)
  Top 0.305: R24.1 C24.1 | R24.1 R25.2 | R25.2 C23.2 R30.1 | R25.2 19.05,54.29 13.65,54.29 13.65,46.67 11.75,46.67 11.75,45.72 IC6.4 | IC6.4 | IC6.4 6.67,45.72 6.67,47.62 v4.76,47.62 X5.2 | IC5.3 24.45,24.77 25.08,24.77 25.08,32.7 29.53,32.7 29.53,36.51 32.07,36.51 32.07,47.94 25.08,47.94 25.08,48.9 24.45,48.9 24.45,54.29 21.27,54.29 R24.1
AXIS  (via drill 0.6)
  Top 0.305: IC2.10 59.05,25.08 59.05,21.59 51.75,21.59 51.75,24.45 43.18,24.45 43.18,25.08 IC1.10 38.42,25.08 38.42,21.91 31.11,21.91 31.11,26.35 v30.8,26.67 | X8.1 v4.76,27.3 6.99,27.3 6.99,20.32 14.29,20.32 IC5.11 v14.29,25.08
  Bottom 0.305: v30.8,26.67 30.48,26.35 15.56,26.35 v14.29,25.08
D+  (via drill 0.6)
  Top 0.305: IC5.21 18.1,16.51 19.05,17.46 28.57,17.46 29.84,16.19 29.84,10.16 32.07,7.94 39.69,7.94 X7.1 v41.91,8.89
  Bottom 0.305: X4.DATA+ 51.12,12.85 51.12,8.89 50.16,7.94 42.86,7.94 v41.91,8.89
D-  (via drill 0.6)
  Top 0.305: IC5.22 19.37,16.19 20,16.83 28.26,16.83 29.21,15.88 29.21,9.84 31.75,7.3 39.69,7.3 X7.2 v41.91,6.35
  Bottom 0.305: X4.DATA- 52.39,13.62 52.39,12.06 51.75,11.43 51.75,8.57 50.48,7.3 42.86,7.3 v41.91,6.35
DIRECTION  (via drill 0.6)
  Top 0.305: X8.2 v4.76,29.84 7.62,29.84 7.62,20.95 13.02,20.95 IC5.12 v13.02,25.08 | IC2.9 59.69,23.81 59.69,20.95 51.12,20.95 51.12,23.81 IC1.9 39.05,23.81 39.05,21.27 30.48,21.27 30.48,25.72 v28.89,27.3
  Bottom 0.305: v28.89,27.3 15.24,27.3 v13.02,25.08
DRIVE_E
  Top 0.406: Q4.2
  Top 0.61: IC7.7 55.56,46.67 53.34,46.67 Q4.2
DRIVE_N
  Top 0.406: Q2.2
  Top 0.61: IC3.7 40.01,46.67 37.78,46.67 Q2.2
DRIVE_S
  Top 0.406: Q3.2
  Top 0.61: IC3.5 42.55,46.35 42.86,46.67 Q3.2
DRIVE_W
  Top 0.406: Q5.2
  Top 0.61: IC7.5 58.1,46.35 58.42,46.67 Q5.2
EAST  (via drill 0.6)
  Top 0.305: R15.2 30.8,31.11 30.8,35.24 33.34,35.24 33.34,48.58 34.29,48.58 v34.29,53.98
  Top 0.406: 52.39,52.7 R14.2
  Top 0.61: Q4.3 52.39,52.7 | R14.2 49.53,53.34 49.53,55.24 v43.81,55.24 43.81,56.83 | CON1.5 43.81,56.83 | CON1.5 43.82,56.83 43.81,56.83
  Bottom 0.305: v34.29,53.98 43.81,53.98 v43.81,55.24
  Bottom 0.61: v43.81,55.24 43.81,57.15
FB1
  Top 0.305: R20.1 R21.2 20.32,33.34 IC8.2
FB2
  Top 0.305: IC8.6 21.59,42.86 23.18,42.86 23.18,44.76 IC10.6
GND  (via drill 0.6, 4.2)
  Top 0.305: R23.1 C16.1 26.99,46.35 | R25.1 C23.1 | 19.91,26.36 XTAL1.4
  Top 0.406: IC3.3 41.27,41.59 C11.1 | IC2.8 53.34,23.81 C8.1 | IC7.3 56.83,41.59 C12.1 | IC1.6 33.02,26.35 C10.1 | IC1.8 36.2,23.81
  other vias: 5,60 65,60 65,5 5,5 62.23,36.2 44.45,40.01 60.01,40.01 44.77,34.29 33.97,28.57 22.23,59.69 38.42,13.97 62.87,53.34 15.24,51.75 20,46.99 7.3,42.55 10.16,43.81 14.92,38.1 7.3,34.92 7.3,52.7 7.3,17.14 21.27,6.99 13.65,5.4 36.51,5.71 25.72,43.81 13.34,30.48 8.89,26.04 26.67,38.1 40.32,52.7 24.13,32.7 25.4,9.53 18.1,25.08 64.45,13.34 18.41,10.16 45.4,13.97 55.24,22.54 34.29,23.81 32.7,13.97 28.26,51.75
  pour Top (isolate 0.305, no thermals): 65,65 5,65 arc90 0,60 0,5 arc90 5,0 65,0 arc90 70,5 70,60 arc90
  pour Bottom (isolate 0.305, no thermals): 0,5 0,60 arc-90 5,65 65,65 arc-90 70,60 70,5 arc-90 65,0 5,0 arc-90
MISO  (via drill 0.6)
  Top 0.305: IC5.24 21.91,13.02 22.54,12.38 22.54,8.26 23.81,6.99 v23.81,4.45 X2.5
MOSI  (via drill 0.6)
  Top 0.305: X2.4 v26.35,4.45 26.35,5.4 23.18,8.57 IC5.25
N$1
  Top 0.305: R1.2 LED1.A
N$3
  Top 0.406: IC4.3 35.56,15.56 34.92,15.56 C3.2
N$4
  Top 0.305: IC4.5 36.83,17.46 C3.1
N$5
  Top 0.305: 19.73,29.21 XTAL1.1 | C17.2 19.91,28.89 XTAL1.1 | IC5.9 16.83,27.62 18.1,28.89 19.41,28.89 XTAL1.1
N$9
  Top 0.305: IC5.10 15.56,26.76 XTAL1.3 15.01,26.99 C18.2
N$11
  Top 0.305: 16.83,11.43 C19.1
  Top 0.61: IC5.20 16.83,11.43
N$27
  Top 0.305: R22.1 C21.1 | C21.1 C16.2 R23.2 | C21.1 R26.1 24.43,42.56 IC10.5
NORTH  (via drill 0.6)
  Top 0.305: 36.83,51.12 34.93,51.12 34.93,47.94 33.97,47.94 33.97,34.61 32.07,34.61 R11.2
  Top 0.406: 36.83,51.12 Q2.3 | R10.2
  Top 0.61: 36.83,51.12 R10.2 35.56,53.34 35.56,55.24 v29.84,55.24 29.82,55.24 CON1.1
  Bottom 0.61: v29.84,55.24 29.84,57.15
PGC/!SS!  (via drill 0.6)
  Top 0.305: IC5.5 21.91,22.23 | 21.91,22.23 22.54,21.59 22.54,19.68 24.13,18.1 28.89,18.1 30.48,16.51 30.48,10.79 v31.43,9.84 | X3.5 v4.76,22.23 5.71,22.23 6.35,21.59 6.35,20 6.99,19.37 19.05,19.37 21.91,22.23
  Bottom 0.305: v31.43,9.84 v31.43,4.45 X2.2
PGD/READY  (via drill 0.6)
  Top 0.305: IC5.4 23.18,21.59 | 23.18,21.59 23.18,20 24.45,18.73 29.21,18.73 31.11,16.83 31.11,11.43 v33.97,8.89 | X3.4 v4.76,19.68 5.71,19.68 6.67,18.73 19.68,18.73 v21.59,20.64 | v23.5,21.59 23.18,21.59
  Bottom 0.305: v33.97,8.89 v33.97,4.45 X2.1 | v21.59,20.64 22.54,20.64 v23.5,21.59
RECEIVE  (via drill 0.6, 1)
  Top 0.305: IC1.13 42.86,28.89 v43.18,29.21 | IC8.3 21.59,34.61 24.13,34.61 24.13,33.66 v28.26,33.66 v28.26,35.56
  Bottom 0.305: v43.18,29.21 38.73,33.66 v28.26,33.66 v28.26,35.56
RECEIVE_E
  Top 0.305: IC1.2 33.66,31.43 | 33.66,31.43 R15.1 | 33.66,31.43 33.66,29.53 31.75,29.53 31.75,22.54 37.78,22.54 37.78,26.35 IC1.11
RECEIVE_N  (via drill 0.6)
  Top 0.305: R11.1 34.61,33.02 34.61,32.7 IC1.1 arc90 36.2,32.76 36.2,33.97 v39.69,33.97 | IC1.14 44.13,30.16 v44.45,29.84
  Bottom 0.305: v44.45,29.84 40.32,33.97 v39.69,33.97
RECEIVE_S
  Top 0.305: IC1.5 IC1.12 R13.1
RECEIVE_W
  Top 0.305: IC1.4 39.05,28.89 39.05,31.43 IC1.15 R17.1
RELEASE_E  (via drill 0.6)
  Top 0.305: IC2.4 v53.66,28.89 52.39,28.89 52.39,29.21 R7.2 | Q4.1 51.44,39.69 v52.7,39.69
  Bottom 0.305: v52.7,39.69 53.66,39.69 53.66,36.83 52.7,35.88 52.7,29.84 v53.66,28.89
RELEASE_N  (via drill 0.6)
  Top 0.305: IC2.5 v52.7,27.62 52.39,27.62 52.39,26.99 R6.2 | 35.56,49.06 Q2.1 35.88,36.51 v45.09,36.51
  Bottom 0.305: v45.09,36.51 52.07,36.51 52.07,28.26 v52.7,27.62
RELEASE_S  (via drill 0.6)
  Top 0.305: IC2.1 52.39,32.7 52.39,33.66 R9.2 | R9.2 50.8,33.66 | Q3.1 40.96,50.16 44.77,50.16 v44.77,45.09 | R9.2 51.12,36.2 47.62,36.2 47.62,45.09 v47.94,45.09
  Bottom 0.305: v44.77,45.09 v47.94,45.09
RELEASE_W  (via drill 0.6)
  Top 0.305: R8.2 IC2.2 57.15,31.43 57.15,35.56 v56.52,35.56 | Q5.1 v56.52,47.31
  Bottom 0.305: v56.52,35.56 v56.52,47.31
SCL1  (via drill 0.6)
  Top 0.305: IC5.17 13.02,13.02 12.38,12.38 R18.2 12.38,6.99 16.19,6.99 v16.19,4.45 X6.2
SCL2  (via drill 0.6)
  Top 0.305: IC5.7 19.37,25.72 22.86,25.72 22.86,31.43 12.38,31.43 12.38,34.61 11.74,34.61 | v11.75,40.64 11.11,40.01 v4.76,40.01 X9.2 1.27,40.01 1.27,36.2 8.57,36.2 8.57,34.61 11.74,34.61 | R29.2 11.74,34.61 | v18.41,45.72 18.73,45.41 IC10.2
  Bottom 0.305: v11.75,40.64 16.83,45.72 v18.41,45.72
SCLK  (via drill 0.6)
  Top 0.305: IC5.26 24.45,13.02 23.81,12.38 23.81,8.89 28.89,3.81 X2.3 v28.89,4.45
SDA1  (via drill 0.6)
  Top 0.305: IC5.18 14.29,13.34 13.34,12.38 13.34,10.16 R19.2 | R19.2 | X6.1 v18.73,4.45 18.73,7.62 14.93,7.62 14.93,8.25 R19.2
SDA2  (via drill 0.6)
  Top 0.305: X9.1 v4.76,37.47 6.67,37.47 6.67,39.37 12.38,39.37 v12.7,39.69 13.02,39.37 13.02,38.1 | IC5.6 20.64,25.08 23.5,25.08 23.5,32.07 13.02,32.07 13.02,38.1 | R28.2 13.02,38.1 | v18.41,44.45 18.73,44.76 IC10.3
  Bottom 0.305: v12.7,39.69 12.7,40.32 16.83,44.45 v18.41,44.45
SIGNAL  (via drill 0.6)
  Top 0.305: v62.55,28.89 IC2.13 | IC5.14 v10.48,28.26 10.48,32.38 v4.76,32.38 X8.3 | v62.55,22.86 60.33,22.86 60.33,20.32 50.48,20.32 50.48,22.86 39.69,22.86 39.69,20.64 29.84,20.64 29.84,25.08 v26.67,28.26
  Bottom 0.305: v62.55,28.89 v62.55,22.86 | v26.67,28.26 v10.48,28.26
SIGNAL_E
  Top 0.305: IC7.2 55.56,38.1 59.05,38.1 59.05,31.43 IC2.15 R5.2
SIGNAL_N  (via drill 0.6)
  Top 0.305: IC3.2 40.01,37.47 v43.81,37.47 | v49.53,37.47 54.29,37.47 54.29,36.83 57.78,36.83 57.78,27.62 IC2.12 62.23,27.62 62.87,26.99 R3.2
  Bottom 0.305: v43.81,37.47 v49.53,37.47
SIGNAL_S  (via drill 0.6)
  Top 0.305: IC3.4 42.55,38.42 v44.77,38.42 | v48.58,38.42 54.93,38.42 54.93,37.47 58.42,37.47 58.42,30.16 IC2.14 63.19,30.16 R4.2
  Bottom 0.305: v44.77,38.42 v48.58,38.42
SIGNAL_W
  Top 0.305: IC7.4 58.1,38.73 63.82,38.73 63.82,33.34 67.31,33.34 67.31,23.5 64.14,23.5 R2.2 | 64.14,25.4 R2.2 | IC2.11 61.91,26.35 62.55,25.72 62.55,25.08 62.87,24.77 R2.2
SOUTH  (via drill 0.6)
  Top 0.305: 41.91,51.12 46.99,51.12 46.99,27.62 R13.2
  Top 0.406: Q3.3 41.91,51.12
  Top 0.61: Q3.3 R12.2 41.91,55.24 v36.83,55.24 CON1.3
  Bottom 0.61: v36.83,55.24 36.83,57.15
STAGE2_IN
  Top 0.305: IC8.5 22.86,40.32 | 22.86,40.32 22.86,38.73 17.14,38.73 C22.1 | R26.2 22.86,40.32
STAGE_1  (via drill 0.6, 1)
  Top 0.305: IC8.1 19.05,35.56 C22.2 16.83,35.56 | 16.83,35.56 16.83,33.34 R20.2 v14.29,33.34 | 16.83,35.56 v15.56,35.56
  Bottom 0.305: v15.56,35.56 14.29,34.29 v14.29,33.34
STAGE_2
  Top 0.305: 20.32,43.5 22.54,43.5 22.54,45.41 IC10.7 | 20.32,43.5 IC8.7 | 20.32,43.5 17.46,43.5 C26.2
VBUS  (via drill 0.6)
  Top 0.305: v53.66,16.83 49.21,16.83 49.21,3.81 v41.91,3.81 X7.3 35.56,3.81 35.56,0.95 11.75,0.95 11.75,7.62 9.21,7.62 9.21,13.97 10.48,13.97 IC5.15
  Bottom 0.305: X4.+5V 53.66,14.89 v53.66,16.83
WEST  (via drill 0.6)
  Top 0.305: R17.2 46.04,31.43 v46.04,49.85 | Q5.3 54.93,51.27 v54.93,49.85
  Top 0.406: R16.2 | Q5.3 57.47,51.12
  Top 0.61: Q5.3 R16.2 57.47,55.24 v50.8,55.24 50.8,57 CON1.7
  Bottom 0.305: v46.04,49.85 v54.93,49.85
  Bottom 0.61: v50.8,55.24 50.8,57.15
ZCD  (via drill 0.6)
  Top 0.305: IC6.1 13.34,43.82 13.34,42.86 9.21,42.86 9.21,44.45 5.71,44.45 5.71,43.81 1.27,43.81 | 1.27,43.81 1.27,50.16 X5.3 v4.76,50.16 | IC5.16 11.75,15.88 1.59,15.88 1.59,35.56 0.64,35.56 0.64,40.64 1.27,40.64 1.27,43.81

### Text on the board
tText: + | - | NS | EW | soldernerd.com